# EAGLE design ch340_civ (EAGLE 7.2.0)
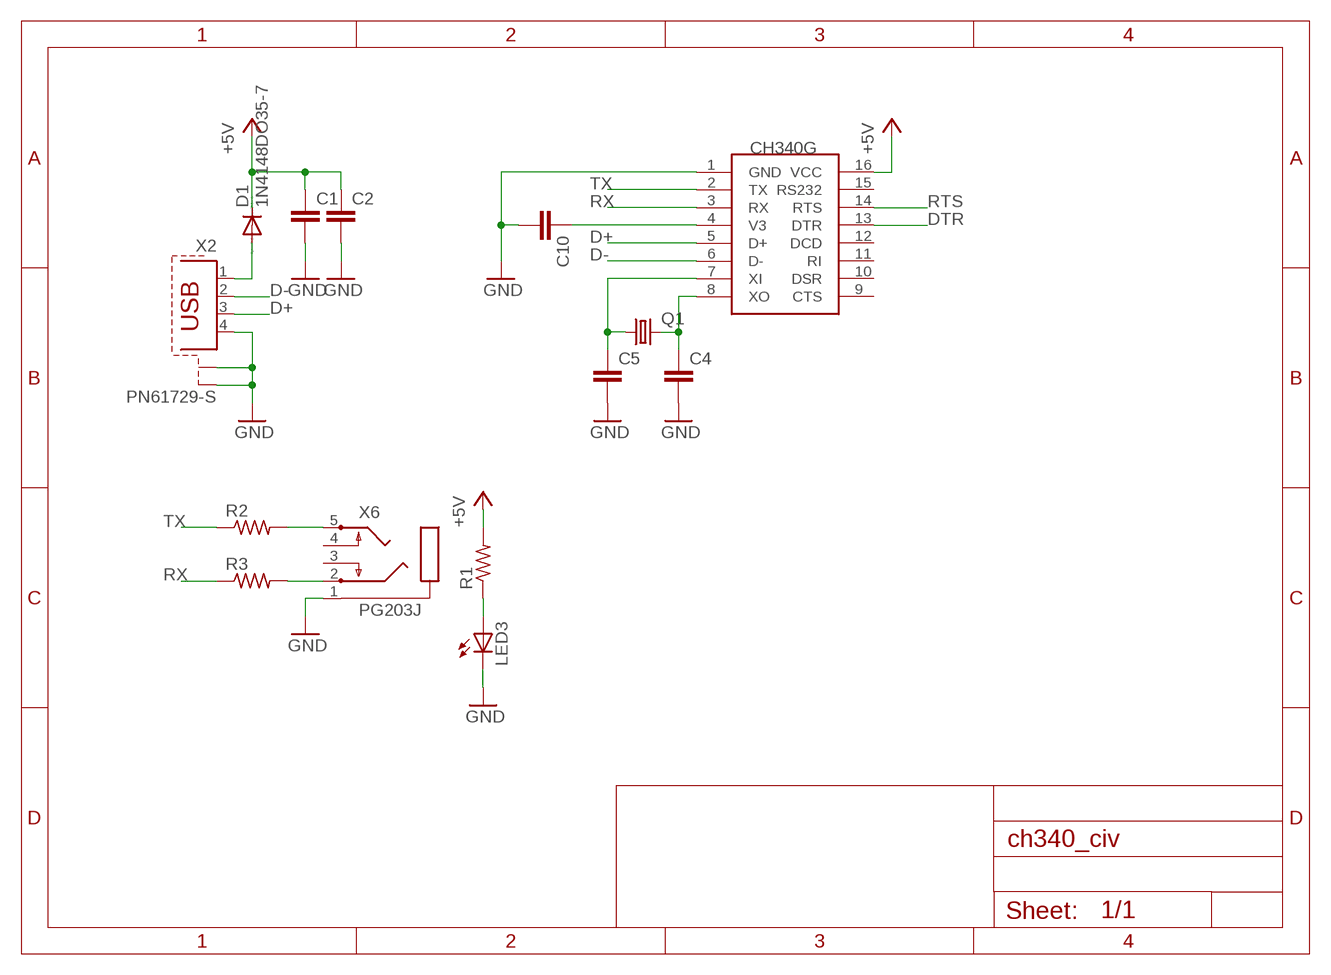
[diagram p0: schematic, sheet 1]

## Parts
C1  C-EUC0805K  [C0805K]
C2  C-EUC0805K  [C0805K]
C4  C-EUC0805K  [C0805K]
C5  C-EUC0805K  [C0805K]
C10  C-EUC0805K  [C0805K]
D1  1N4148DO35-7  [DO35-7]
LED3  LED3MM  [LED3MM]
Q1  CRYSTALHC49S  [HC49/S]
R1  R-US_R0805  [R0805]
R2  R-US_M0805  [M0805]
R3  R-US_M0805  [M0805]
U$1  CH340G  [SOIC16]
X2  PN61729-S  [PN61729-S]
X6  PG203J  [PG203J]

## Nets
+5V: C1.1 C2.1 D1.C R1.2 U$1.16(VCC)
D+: U$1.5(D+) X2.3
D-: U$1.6(D-) X2.2
DTR: U$1.13(DTR)
GND: C1.2 C2.2 C4.2 C5.2 C10.2 LED3.K(C) U$1.1(GND) X2.4 X2.S1 X2.S2 X6.1
N$1: D1.A X2.1
N$2: C4.1 Q1.2 U$1.8(XO)
N$3: C5.1 Q1.1 U$1.7(XI)
N$4: C10.1 U$1.4(V3)
N$10: LED3.A R1.1
N$11: R2.2 X6.5
N$12: R3.2 X6.2
RTS: U$1.14(RTS)
RX: R3.1 U$1.3(RX)
TX: R2.1 U$1.2(TX)
Unconnected: U$1.9(CTS) U$1.10(DSR) U$1.11(RI) U$1.12(DCD) U$1.15(RS232) X6.3 X6.4

## Library data of the parts
C1 C2 C4 C5 C10 = rcl:C-EU: CAPACITOR, European symbol
D1 = diode:1N4148: DIODE high speed (Philips)
LED3 = led:LED: LED OSRAM: - CHIPLED LG R971, LG N971, LY N971, LG Q971, LY Q971, LO R971, LY R971 LH N974, LH R974 LS Q976, LO Q976, LY Q976 LO Q996 - Hyper CHIPLED LW Q18S LB Q993, LB Q99A, LB R99A - SideLED LS A670, LO A670, LY A670, LG A670, LP A670 LB A673, LV A673, LT A673, LW A673 LH A674 LY A675 LS A676, LA A676, LO A676, LY A676, LW A676 LS A679, LY A679, LG A679 - Hyper Micro SIDELED® LS Y876, LA Y876, LO Y876, LY Y876 LT Y87S - SmartLED LW L88C, LW L88S LB L89C, LB L89S, LG L890 LS L89K, LO L89K, LY L89K LS L896, LA L896, LO L896, LY L896 - TOPLED LS T670, LO T670, LY T670, LG T670, LP T670 LSG T670, LSP T670, LSY T670, LOP T670, LYG T670 LG T671, LOG T671, LSG T671 LB T673, LV T673, LT T673, LW T673 LH T674 LS T676, LA T676, LO T676, LY T676, LB T676, LH T676, LSB T676, LW T676 LB T67C, LV T67C, LT T67C, LS T67K, LO T67K, LY T67K, LW E67C LS E67B, LA E67B, LO E67B, LY E67B, LB E67C, LV E67C, LT E67C LW T67C LS T679, LY T679, LG T679 LS T770, LO T770, LY T770, LG T770, LP T770 LB T773, LV T773, LT T773, LW T773 LH T774 LS E675, LA E675, LY E675, LS T675 LS T776, LA T776, LO T776, LY T776, LB T776 LHGB T686 LT T68C, LB T68C - Hyper Mini TOPLED® LB M676 - Mini TOPLED Santana® LG M470 LS M47K, LO M47K, LY M47K Source: http://www.osram.convergy.de LUXEON: - LUMILED® LXK2-PW12-R00, LXK2-PW12-S00, LXK2-PW14-U00, LXK2-PW14-V00 LXK2-PM12-R00, LXK2-PM12-S00, LXK2-PM14-U00 LXK2-PE12-Q00, LXK2-PE12-R00, LXK2-PE12-S00, LXK2-PE14-T00, LXK2-PE14-U00 LXK2-PB12-K00, LXK2-PB12-L00, LXK2-PB12-M00, LXK2-PB14-N00, LXK2-PB14-P00, LXK2-PB14-Q00 LXK2-PR12-L00, LXK2-PR12-M00, LXK2-PR14-Q00, LXK2-PR14-R00 LXK2-PD12-Q00, LXK2-PD12-R00, LXK2-PD12-S00 LXK2-PH12-R00, LXK2-PH12-S00 LXK2-PL12-P00, LXK2-PL12-Q00, LXK2-PL12-R00 Source: www.luxeon.com KINGBRIGHT: KA-3528ASYC Source: www.kingbright.com
Q1 = crystal:CRYSTAL: CRYSTAL; OC_FARNELL: 1667008; OC_NEWARK: unknown
R1-R3 = rcl:R-US_: RESISTOR, American symbol
U$1 = ch340g:CH340G
X2 = con-berg:PN61729-S: BERG USB connector; OC_FARNELL: unknown; OC_NEWARK: unknown
X6 = con-hirschmann:PG203J: MIC/HEADPHONE JACK KS-S stereo microphone/headphone jack PG203JN (Schukat); OC_FARNELL: unknown; OC_NEWARK: unknown

## Board
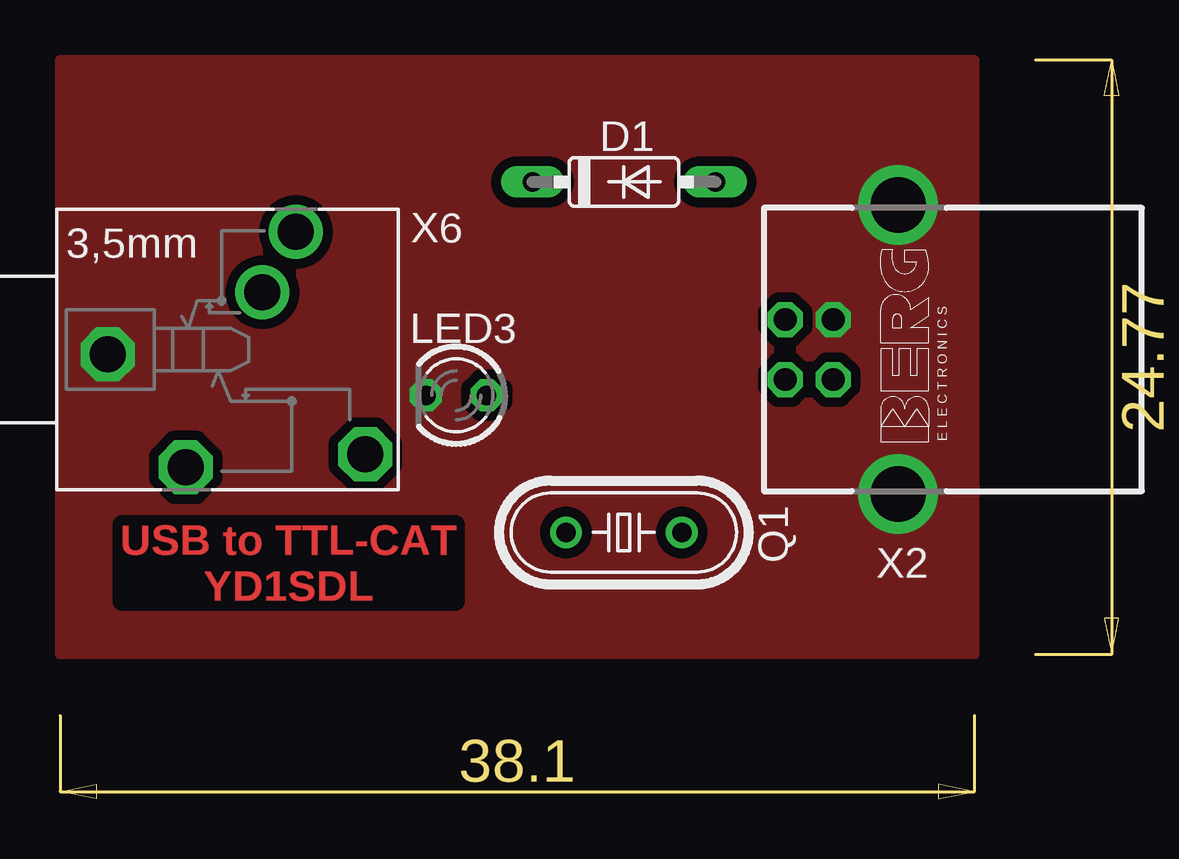
[diagram p1: board, top side]
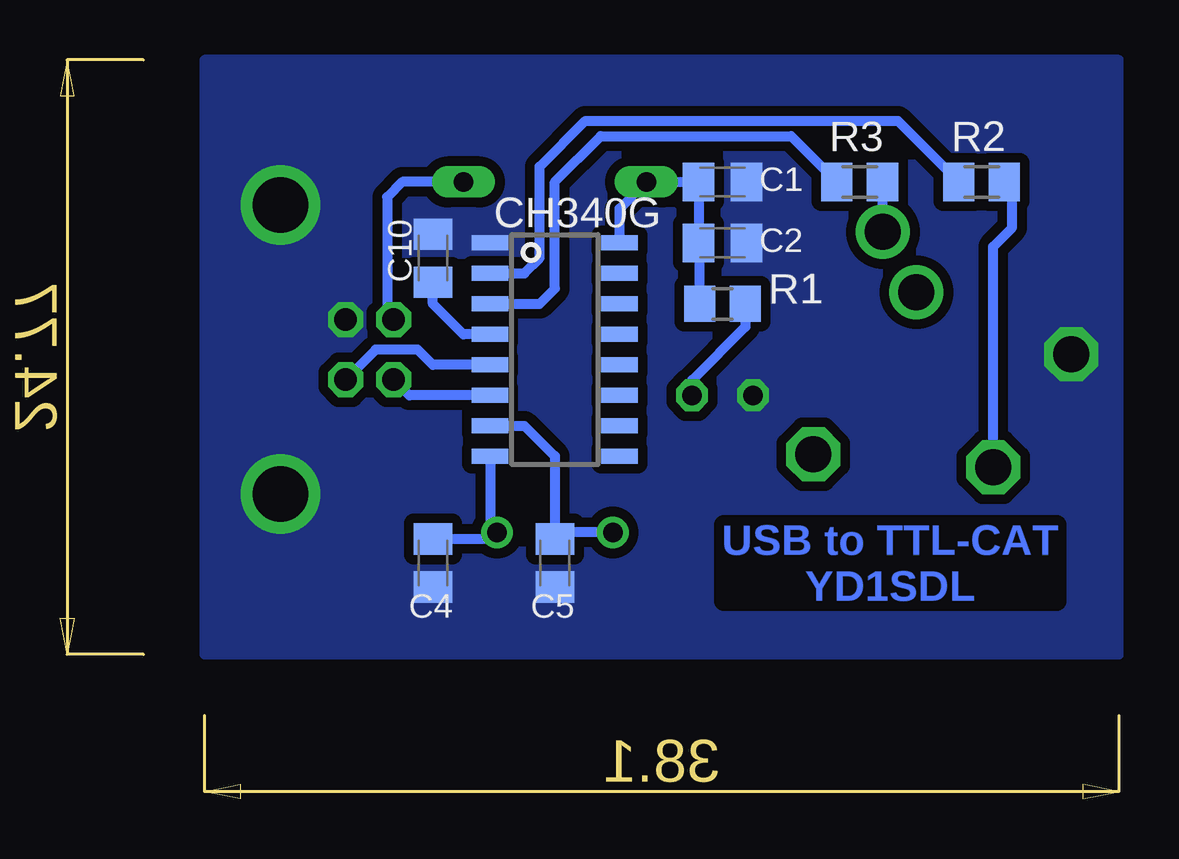
[diagram p2: board, bottom side, seen from below]

Size 44.11 x 30.78 mm. Coordinates in mm from the lower left corner, seen from the top.
Copper layers (1*16): Top 0.035mm / dielectric 1.5mm / Bottom 0.035mm
Design rules "default": minimum track width 10mil, minimum drill 24mil, track to track 8mil, track to pad 8mil, pad to pad 8mil, via to via 8mil, smd to smd 8mil, copper to edge 40mil, drill to drill 8mil, minimum pad ring 10mil, minimum via ring 8mil, stop-mask expansion 4mil, vias tented up to drill 0mil, thermal gap 10mil

### Footprints (pad centres in the part's own frame; a part is rotated, then mirrored left to right if it is on the bottom)
C0805K = smd 1.3 x 1.6: 1 -1,0; 2 1,0
DO35-7 = drill 0.813 long: A 3.81,0; C -3.81,0
LED3MM = drill 0.813 octagon: A -1.27,0; K 1.27,0
HC49/S = drill 0.813: 1 -2.413,0; 2 2.413,0
R0805 = smd 1.3 x 1.5: 1 -0.95,0; 2 0.95,0
M0805 = smd 1.3 x 1.6: 1 -0.95,0; 2 0.95,0
SOIC16 = smd 0.635 x 1.524: 1 -4.445,-2.695; 2 -3.175,-2.695; 3 -1.905,-2.695; 4 -0.635,-2.695; 5 0.635,-2.695; 6 1.905,-2.695; 7 3.175,-2.695; 8 4.445,-2.695; 9 4.445,2.695; 10 3.175,2.695; 11 1.905,2.695; 12 0.635,2.695; 13 -0.635,2.695; 14 -1.905,2.695; 15 -3.175,2.695; 16 -4.445,2.695
PN61729-S = drill 0.95 octagon: 1 1.25,4.71; 2 -1.25,4.71; 3 -1.25,2.71; 4 1.25,2.71 | drill 2.3 pad 2.9: S1 -6.02,0; S2 6.02,0
PG203J = drill 1.499 octagon: 1 -5.004,-0.203; 4 5.74,-4.369; 5 -1.753,-4.902 | drill 1.499: 2 2.845,4.902; 3 1.448,2.388

### Placement (x,y rotation side)
C1  16.51,25.7 0 bottom
C2  16.51,23.16 0 bottom
C4  28.58,9.82 270 bottom
C5  23.5,9.82 270 bottom
C10  28.58,22.52 90 bottom
D1  23.5,25.7 0 top
LED3  16.51,16.81 180 top
Q1  23.5,11.09 0 top
R1  16.51,20.62 180 bottom
R2  5.72,25.7 0 bottom
R3  10.8,25.7 0 bottom
U$1  23.5,18.71 270 bottom
X2  34.92,18.71 90 top
X6  6.99,18.71 0 top

### Tracks (layer width: path | path; a pad name or v marks a point on that pad's centre or on a via)
+5V
  Bottom 0.406: R1.2 17.46,23.11 C2.1 C1.1 D1.C 20.8,24.58 U$1.16
D+
  Bottom 0.406: U$1.5 28.58,18.08 29.21,18.71 30.96,18.71 X2.3
D-
  Bottom 0.406: U$1.6 29.56,16.81 X2.2
GND
  pour Bottom (isolate 0.406, no thermals): 38.1,6.01 0,6.01 0,30.78 38.1,30.78
  pour Top (isolate 0.406, no thermals): 0,30.78 38.1,30.78 38.1,6.01 0,6.01
N$1
  Bottom 0.406: D1.A 29.85,25.7 30.48,25.06 30.48,20.23 X2.1
N$2
  Bottom 0.406: U$1.8 26.19,11.38 Q1.2 26.18,10.82 C4.1
N$3
  Bottom 0.406: U$1.7 24.77,15.54 23.5,14.27 C5.1 23.23,11.09 Q1.1
N$4
  Bottom 0.406: U$1.4 27.3,19.35 28.58,20.62 C10.1
N$10
  Bottom 0.406: R1.1 15.56,19.66 17.78,17.44 LED3.A
N$11
  Bottom 0.406: X6.5 5.23,23.01 4.45,23.79 4.45,25.38 R2.2
N$12
  Bottom 0.406: R3.2 9.85,23.63 X6.2
RX
  Bottom 0.406: U$1.3 24.13,20.62 23.5,21.25 23.5,25.7 21.59,27.6 13.65,27.6 R3.1
TX
  Bottom 0.406: U$1.2 24.77,21.89 24.13,22.52 24.13,26.33 22.23,28.24 9.21,28.24 R2.1

### Text on the board
Top: USB to TTL-CAT / YD1SDL
Bottom: USB to TTL-CAT / YD1SDL